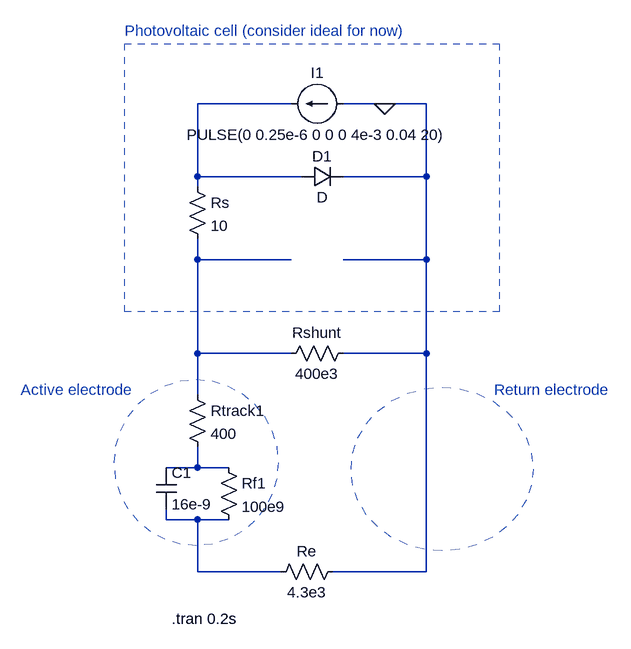
[diagram p0: schematic ReTRInaModel.asc]
ReTRInaModel.asc, the LTspice schematic file:
Version 4
SHEET 1 880 680
WIRE 320 -128 176 -128
WIRE 464 -128 400 -128
WIRE 528 -128 464 -128
WIRE 176 -16 176 -128
WIRE 336 -16 176 -16
WIRE 528 -16 528 -128
WIRE 528 -16 400 -16
WIRE 176 0 176 -16
WIRE 176 112 176 80
WIRE 320 112 176 112
WIRE 528 112 528 -16
WIRE 528 112 400 112
WIRE 176 256 176 112
WIRE 320 256 176 256
WIRE 528 256 528 112
WIRE 528 256 400 256
WIRE 176 320 176 256
WIRE 176 432 176 400
WIRE 176 432 128 432
WIRE 224 432 176 432
WIRE 128 512 128 496
WIRE 176 512 128 512
WIRE 224 512 176 512
WIRE 176 592 176 512
WIRE 304 592 176 592
WIRE 528 592 528 256
WIRE 528 592 384 592
FLAG 464 -128 0
SYMBOL res 416 240 R90
WINDOW 0 0 56 VBottom 2
WINDOW 3 32 56 VTop 2
SYMATTR InstName Rshunt
SYMATTR Value 400e3
SYMBOL res 208 416 R0
SYMATTR InstName Rf1
SYMATTR Value 100e9
SYMBOL cap 112 432 R0
SYMATTR InstName C1
SYMATTR Value 16e-9
SYMBOL res 160 -16 R0
SYMATTR InstName Rs
SYMATTR Value 10
SYMBOL res 160 304 R0
SYMATTR InstName Rtrack1
SYMATTR Value 400
SYMBOL current 400 -128 R90
WINDOW 0 -32 40 VBottom 2
WINDOW 3 32 40 VTop 2
SYMATTR InstName I1
SYMATTR Value PULSE(0 0.25e-6 0 0 0 4e-3 0.04 20)
SYMBOL diode 336 0 R270
WINDOW 0 32 32 VTop 2
WINDOW 3 0 32 VBottom 2
SYMATTR InstName D1
SYMBOL res 288 608 R270
WINDOW 0 32 56 VTop 2
WINDOW 3 0 56 VBottom 2
SYMATTR InstName Re
SYMATTR Value 4.3e3
TEXT 136 664 Left 2 !.tran 0.2s
TEXT -96 312 Left 2 ;Active electrode
TEXT 632 312 Left 2 ;Return electrode
TEXT 64 -240 Left 2 ;Photovoltaic cell (consider ideal for now)
RECTANGLE Normal 64 -220 640 192 2
CIRCLE Normal 48 296 300 552 2
CIRCLE Normal 412 308 692 560 2

The netlist it stands for:
* ReTRInaModel.asc
Rshunt 0 N002 400e3
Rf1 N003 N004 100e9
C1 N003 N004 16e-9
Rs N001 N002 10
Rtrack1 N002 N003 400
I1 0 N001 PULSE(0 0.25e-6 0 0 0 4e-3 0.04 20)
D1 N001 0 D
Re N004 0 4.3e3
.model D D
.lib standard.dio
.tran 0.2s
* Active electrode
* Return electrode
* Photovoltaic cell (consider ideal for now)
.backanno
.end